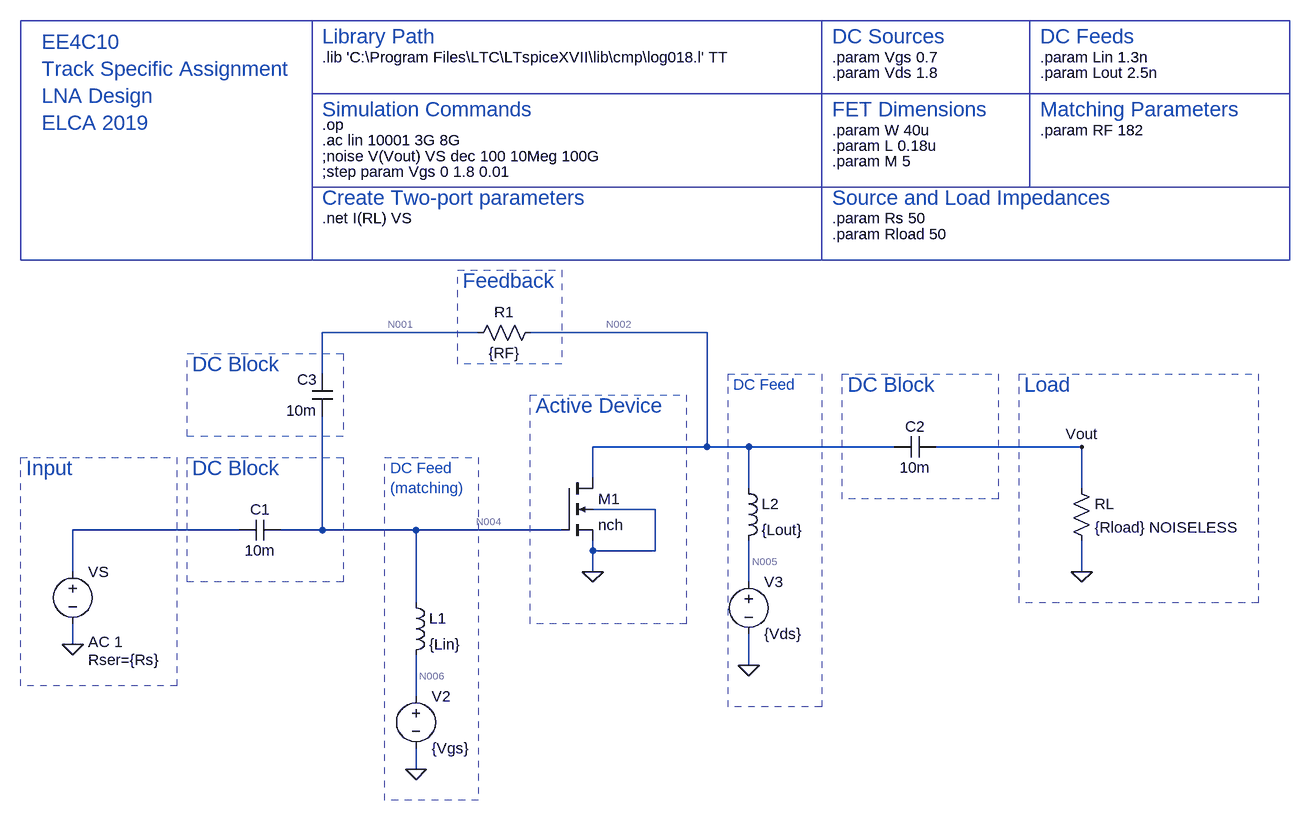
[diagram p0: schematic EE4C10_RF_LNA_wFB_student_2021.asc]
EE4C10_RF_LNA_wFB_student_2021.asc, the LTspice schematic file:
Version 4
SHEET 1 1696 980
WIRE -48 -112 -288 -112
WIRE 304 -112 32 -112
WIRE -288 -48 -288 -112
WIRE 304 64 304 -112
WIRE 304 64 128 64
WIRE 368 64 304 64
WIRE 592 64 368 64
WIRE 880 64 656 64
WIRE 128 112 128 64
WIRE 368 128 368 64
WIRE 880 128 880 64
WIRE 224 160 128 160
WIRE -416 192 -672 192
WIRE -288 192 -288 16
WIRE -288 192 -352 192
WIRE -144 192 -288 192
WIRE 80 192 -144 192
WIRE 128 224 128 208
WIRE 224 224 224 160
WIRE 224 224 128 224
WIRE -672 256 -672 192
WIRE 128 256 128 224
WIRE 880 256 880 208
WIRE 368 272 368 208
WIRE -144 304 -144 192
WIRE -672 368 -672 336
WIRE 368 400 368 352
WIRE -144 448 -144 384
WIRE -144 560 -144 528
FLAG -672 368 0
FLAG -144 560 0
FLAG 128 256 0
FLAG 368 400 0
FLAG 880 256 0
FLAG 880 64 Vout
SYMBOL voltage -672 240 R0
WINDOW 123 24 124 Left 2
WINDOW 39 24 152 Left 2
SYMATTR Value2 AC 1
SYMATTR SpiceLine Rser={Rs}
SYMATTR InstName VS
SYMATTR Value ""
SYMBOL cap -352 176 R90
WINDOW 0 0 32 VBottom 2
WINDOW 3 32 32 VTop 2
SYMATTR InstName C1
SYMATTR Value 10m
SYMBOL ind -160 288 R0
SYMATTR InstName L1
SYMATTR Value {Lin}
SYMBOL voltage -144 432 R0
SYMATTR InstName V2
SYMATTR Value {Vgs}
SYMBOL nmos4 80 112 R0
SYMATTR InstName M1
SYMATTR Value nch
SYMATTR Value2 l={L} w={W} m={M}
SYMBOL ind 352 112 R0
SYMATTR InstName L2
SYMATTR Value {Lout}
SYMBOL voltage 368 256 R0
SYMATTR InstName V3
SYMATTR Value {Vds}
SYMBOL res 864 112 R0
SYMATTR InstName RL
SYMATTR Value {Rload} NOISELESS
SYMBOL cap 656 48 R90
WINDOW 0 0 32 VBottom 2
WINDOW 3 32 32 VTop 2
SYMATTR InstName C2
SYMATTR Value 10m
SYMBOL cap -272 16 R180
WINDOW 0 24 56 Left 2
WINDOW 3 24 8 Left 2
SYMATTR InstName C3
SYMATTR Value 10m
SYMBOL res 48 -128 R90
WINDOW 0 0 56 VBottom 2
WINDOW 3 32 56 VTop 2
SYMATTR InstName R1
SYMATTR Value {RF}
TEXT 496 -288 Left 2 !.param Rs 50
TEXT 816 -536 Left 2 !.param Lin 1.3n
TEXT 496 -536 Left 2 !.param Vgs 0.7
TEXT 496 -424 Left 2 !.param W 40u
TEXT 496 -400 Left 2 !.param L 0.18u
TEXT 496 -512 Left 2 !.param Vds 1.8
TEXT 816 -512 Left 2 !.param Lout 2.5n
TEXT -288 -432 Left 2 !.op
TEXT 496 -264 Left 2 !.param Rload 50
TEXT 496 -376 Left 2 !.param M 5
TEXT -288 -360 Left 2 !;step param Vgs 0 1.8 0.01
TEXT -288 -408 Left 2 !.ac lin 10001 3G 8G
TEXT -288 -288 Left 2 !.net I(RL) VS
TEXT -288 -320 Left 3 ;Create Two-port parameters
TEXT -288 -568 Left 3 ;Library Path
TEXT -288 -456 Left 3 ;Simulation Commands
TEXT 496 -568 Left 3 ;DC Sources
TEXT 496 -456 Left 3 ;FET Dimensions
TEXT 496 -320 Left 3 ;Source and Load Impedances
TEXT 816 -456 Left 3 ;Matching Parameters
TEXT -744 96 Left 3 ;Input
TEXT -488 96 Left 3 ;DC Block
TEXT 520 -32 Left 3 ;DC Block
TEXT -184 96 Left 2 ;DC Feed\n(matching)
TEXT 344 -32 Left 2 ;DC Feed
TEXT 40 0 Left 3 ;Active Device
TEXT 792 -32 Left 3 ;Load
TEXT -288 -384 Left 2 !;noise V(Vout) VS dec 100 10Meg 100G
TEXT 816 -568 Left 3 ;DC Feeds
TEXT -488 -64 Left 3 ;DC Block
TEXT -72 -192 Left 3 ;Feedback
TEXT 816 -424 Left 2 !.param RF 182
TEXT -288 -536 Left 2 !.lib 'C:\\Program Files\\LTC\\LTspiceXVII\\lib\\cmp\\log018.l' TT
TEXT -720 -560 Left 3 ;EE4C10\nTrack Specific Assignment\nLNA Design\nELCA 2019
RECTANGLE Normal 800 -480 480 -592
RECTANGLE Normal 800 -336 480 -480
RECTANGLE Normal 1200 -224 480 -336
RECTANGLE Normal 1200 -336 800 -480
RECTANGLE Normal 480 -592 -304 -480
RECTANGLE Normal 480 -336 -304 -480
RECTANGLE Normal -304 -224 480 -336
RECTANGLE Normal -512 432 -752 80 2
RECTANGLE Normal -48 608 -192 80 2
RECTANGLE Normal -256 272 -496 80 2
RECTANGLE Normal 752 144 512 -48 2
RECTANGLE Normal 480 464 336 -48 2
RECTANGLE Normal 272 336 32 -16 2
RECTANGLE Normal 1152 304 784 -48 2
RECTANGLE Normal 1200 -480 800 -592
RECTANGLE Normal -256 48 -496 -80 2
RECTANGLE Normal 80 -64 -80 -208 2
RECTANGLE Normal -752 -224 -304 -592

The netlist it stands for:
* EE4C10_RF_LNA_wFB_student_2021.asc
VS N003 0 AC 1 Rser={Rs}
C1 N004 N003 10m
L1 N004 N006 {Lin}
V2 N006 0 {Vgs}
M1 N002 N004 0 0 nch l={L} w={W} m={M}
L2 N002 N005 {Lout}
V3 N005 0 {Vds}
RL Vout 0 {Rload} NOISELESS
C2 Vout N002 10m
C3 N004 N001 10m
R1 N002 N001 {RF}
.model NMOS NMOS
.model PMOS PMOS
.lib standard.mos
.param Rs 50
.param Lin 1.3n
.param Vgs 0.7
.param W 40u
.param L 0.18u
.param Vds 1.8
.param Lout 2.5n
.op
.param Rload 50
.param M 5
;step param Vgs 0 1.8 0.01
.ac lin 10001 3G 8G
.net I(RL) VS
* Create Two-port parameters
* Library Path
* Simulation Commands
* DC Sources
* FET Dimensions
* Source and Load Impedances
* Matching Parameters
* Input
* DC Block
* DC Block
* DC Feed
* (matching)
* DC Feed
* Active Device
* Load
;noise V(Vout) VS dec 100 10Meg 100G
* DC Feeds
* DC Block
* Feedback
.param RF 182
.lib 'C:\Program Files\LTC\LTspiceXVII\lib\cmp\log018.l' TT
* EE4C10
* Track Specific Assignment
* LNA Design
* ELCA 2019
.backanno
.end

* Results of the author's LTspice run, read from the files saved beside the schematic
* Operating Point, zero values left out:
*   V(n004) = 700 mV
*   V(n006) = 700 mV
*   V(n002) = 1.8 V
*   V(n005) = 1.8 V
*   V(n001) = 1.8 V
*   Id(M1) = 11.9 mA
*   Ib(M1) = -7.201 µA
*   Is(M1) = -11.89 mA
*   I(L2) = -11.9 mA
*   I(V3) = -11.9 mA
* From the log:
*   Semiconductor Device Operating Points:
*                           --- BSIM3 MOSFETS ---
*   Name:        m1
*   Model:      nch.3
*   Id:        1.19e-02
*   Vgs:       7.00e-01
*   Vds:       1.80e+00
*   Vbs:       0.00e+00
*   Vth:       5.08e-01
*   Vdsat:     1.68e-01
*   Gm:        7.74e-02
*   Gds:       1.62e-03
*   Gmb        2.20e-02
*   Cbd:       0.00e+00
*   Cbs:       0.00e+00
*   Cgsov:     7.33e-14
*   Cgdov:     7.33e-14
*   Cgbov:     1.59e-16
*   dQgdVgb:   3.71e-13
*   dQgdVdb:  -7.29e-14
*   dQgdVsb:  -2.64e-13
*   dQddVgb:  -7.33e-14
*   dQddVdb:   7.33e-14
*   dQddVsb:   4.52e-17
*   dQbdVgb:  -4.05e-14
*   dQbdVdb:   8.74e-17
*   dQbdVsb:  -4.49e-14